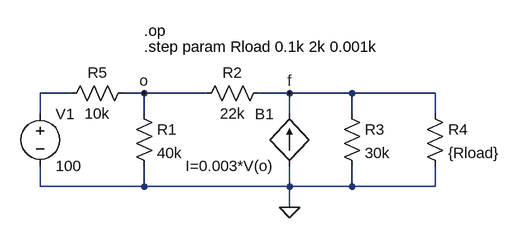
[diagram p0: schematic PotenciaInfinita_4.69.asc]
PotenciaInfinita_4.69.asc, the LTspice schematic file:
Version 4
SHEET 1 880 680
WIRE -288 80 -336 80
WIRE -176 80 -208 80
WIRE -80 80 -176 80
WIRE 48 80 0 80
WIRE 144 80 48 80
WIRE 272 80 144 80
WIRE -336 112 -336 80
WIRE -176 112 -176 80
WIRE 48 112 48 80
WIRE 144 112 144 80
WIRE 272 112 272 80
WIRE -336 224 -336 192
WIRE -176 224 -176 192
WIRE -176 224 -336 224
WIRE 48 224 48 192
WIRE 48 224 -176 224
WIRE 144 224 144 192
WIRE 144 224 48 224
WIRE 272 224 272 192
WIRE 272 224 144 224
WIRE 48 256 48 224
FLAG -176 80 o
FLAG 48 80 f
FLAG 48 256 0
SYMBOL res -192 96 R0
SYMATTR InstName R1
SYMATTR Value 40k
SYMBOL res 16 64 R90
WINDOW 0 0 56 VBottom 2
WINDOW 3 32 56 VTop 2
SYMATTR InstName R2
SYMATTR Value 22k
SYMBOL res 128 96 R0
SYMATTR InstName R3
SYMATTR Value 30k
SYMBOL bi 48 192 R180
WINDOW 0 24 80 Left 2
WINDOW 3 24 0 Left 2
SYMATTR InstName B1
SYMATTR Value I=0.003*V(o)
SYMBOL res 256 96 R0
SYMATTR InstName R4
SYMATTR Value {Rload}
SYMBOL res -192 64 R90
WINDOW 0 0 56 VBottom 2
WINDOW 3 32 56 VTop 2
SYMATTR InstName R5
SYMATTR Value 10k
SYMBOL voltage -336 96 R0
WINDOW 123 0 0 Left 0
WINDOW 39 0 0 Left 0
SYMATTR InstName V1
SYMATTR Value 100
TEXT -176 -16 Left 2 !.op
TEXT -176 8 Left 2 !.step param Rload 0.1k 2k 0.001k

The netlist it stands for:
* PotenciaInfinita_4.69.asc
R1 o 0 40k
R2 f o 22k
R3 f 0 30k
B1 0 f I=0.003*V(o)
R4 f 0 {Rload}
R5 o N001 10k
V1 N001 0 100
.op
.step param Rload 0.1k 2k 0.001k
.backanno
.end